# Altium schematic sheet PMOS-SOT23.schdoc
size 127 x 101 mm
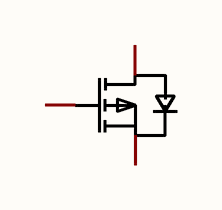
[diagram p0: PMOS-SOT23.schdoc]

## Parts
U?  AO3401-ED  [SOT-23-3_L2.9-W1.3-P0.95-LS2.4-BR]  (value not drawn)

## Nets

Not connected (* = marked no-connect by the designer): U? 1(G) 2(S) 3(D)

## Library data of the parts
U? = AO3401-ED: Manufacturer: HXY MOSFET(华轩阳电子); Add into BOM: yes; Drain Source Voltage (Vdss): 20V; Continuous Drain Current (Id): 3A; Power Dissipation (Pd): 700mW; Drain Source On Resistance (RDS(on)@Vgs,Id): 110mΩ@10V,2A; Gate Threshold Voltage (Vgs(th)@Id): 1V@250uA; Input Capacitance (Ciss@Vds): 260pF@10V; Symbol: AO3401-ED; Device: AO3401-ED; LCSC Part Name: P沟道 耐压:20V 电流:3A; Supplier Part: C4748724; Manufacturer Part: AO3401-ED; Supplier Footprint: SOT-23; JLCPCB Part Class: Extended Part; Datasheet: https://atta.szlcsc.com/upload/public/pdf/source/20230515/FFFA1714A3982D8C281238E73BA4891D.pdf; Supplier: LCSC; Convert to PCB: yes; Type: P沟道